# Altium schematic sheet PART1.SchDoc
size 558 x 431 mm
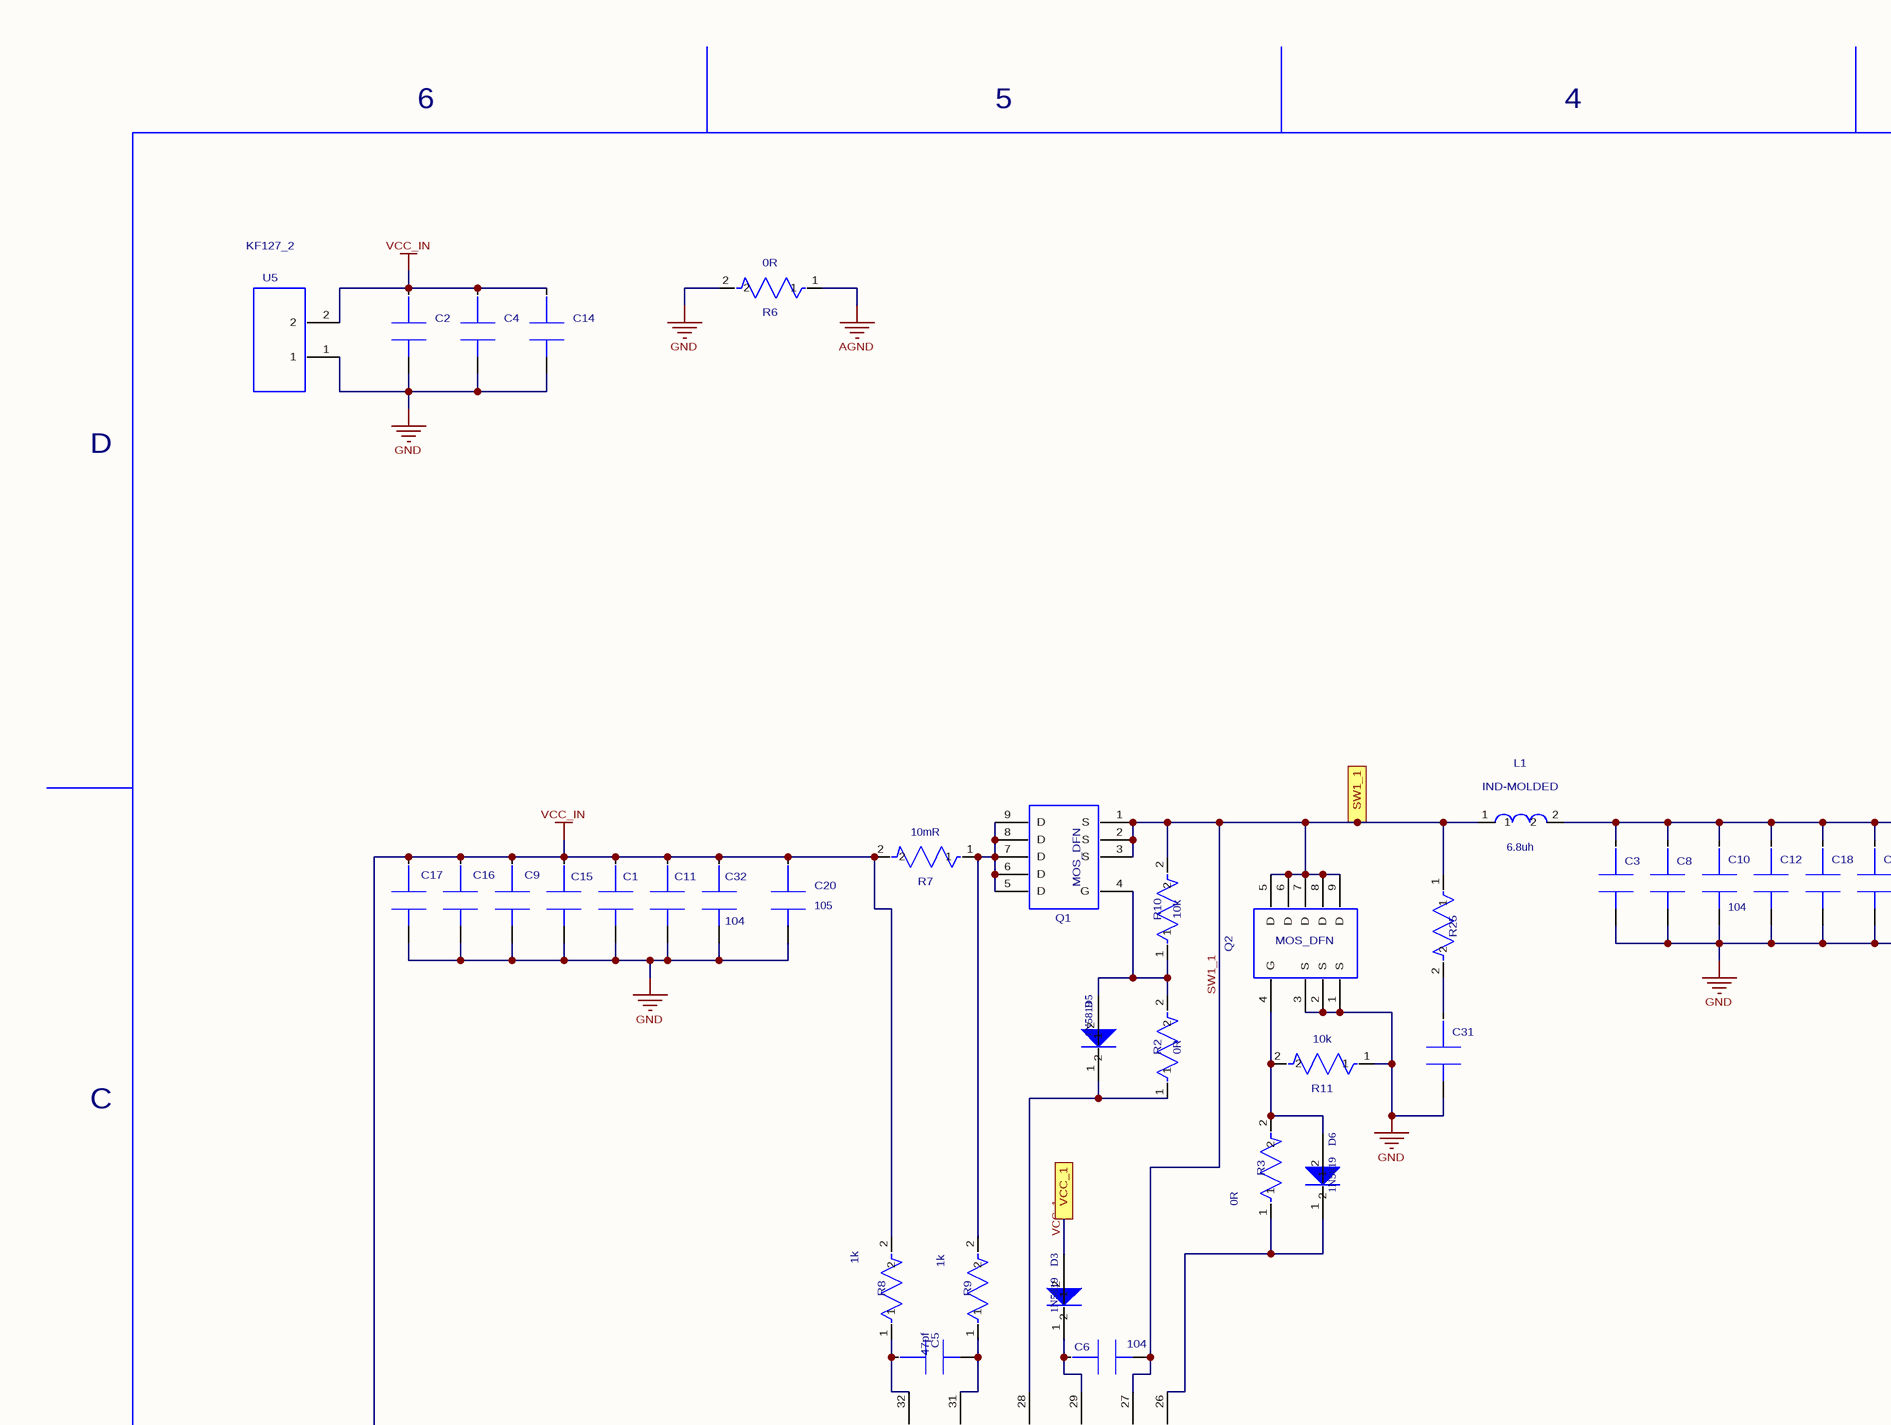
[diagram p0: PART1.SchDoc, top left]
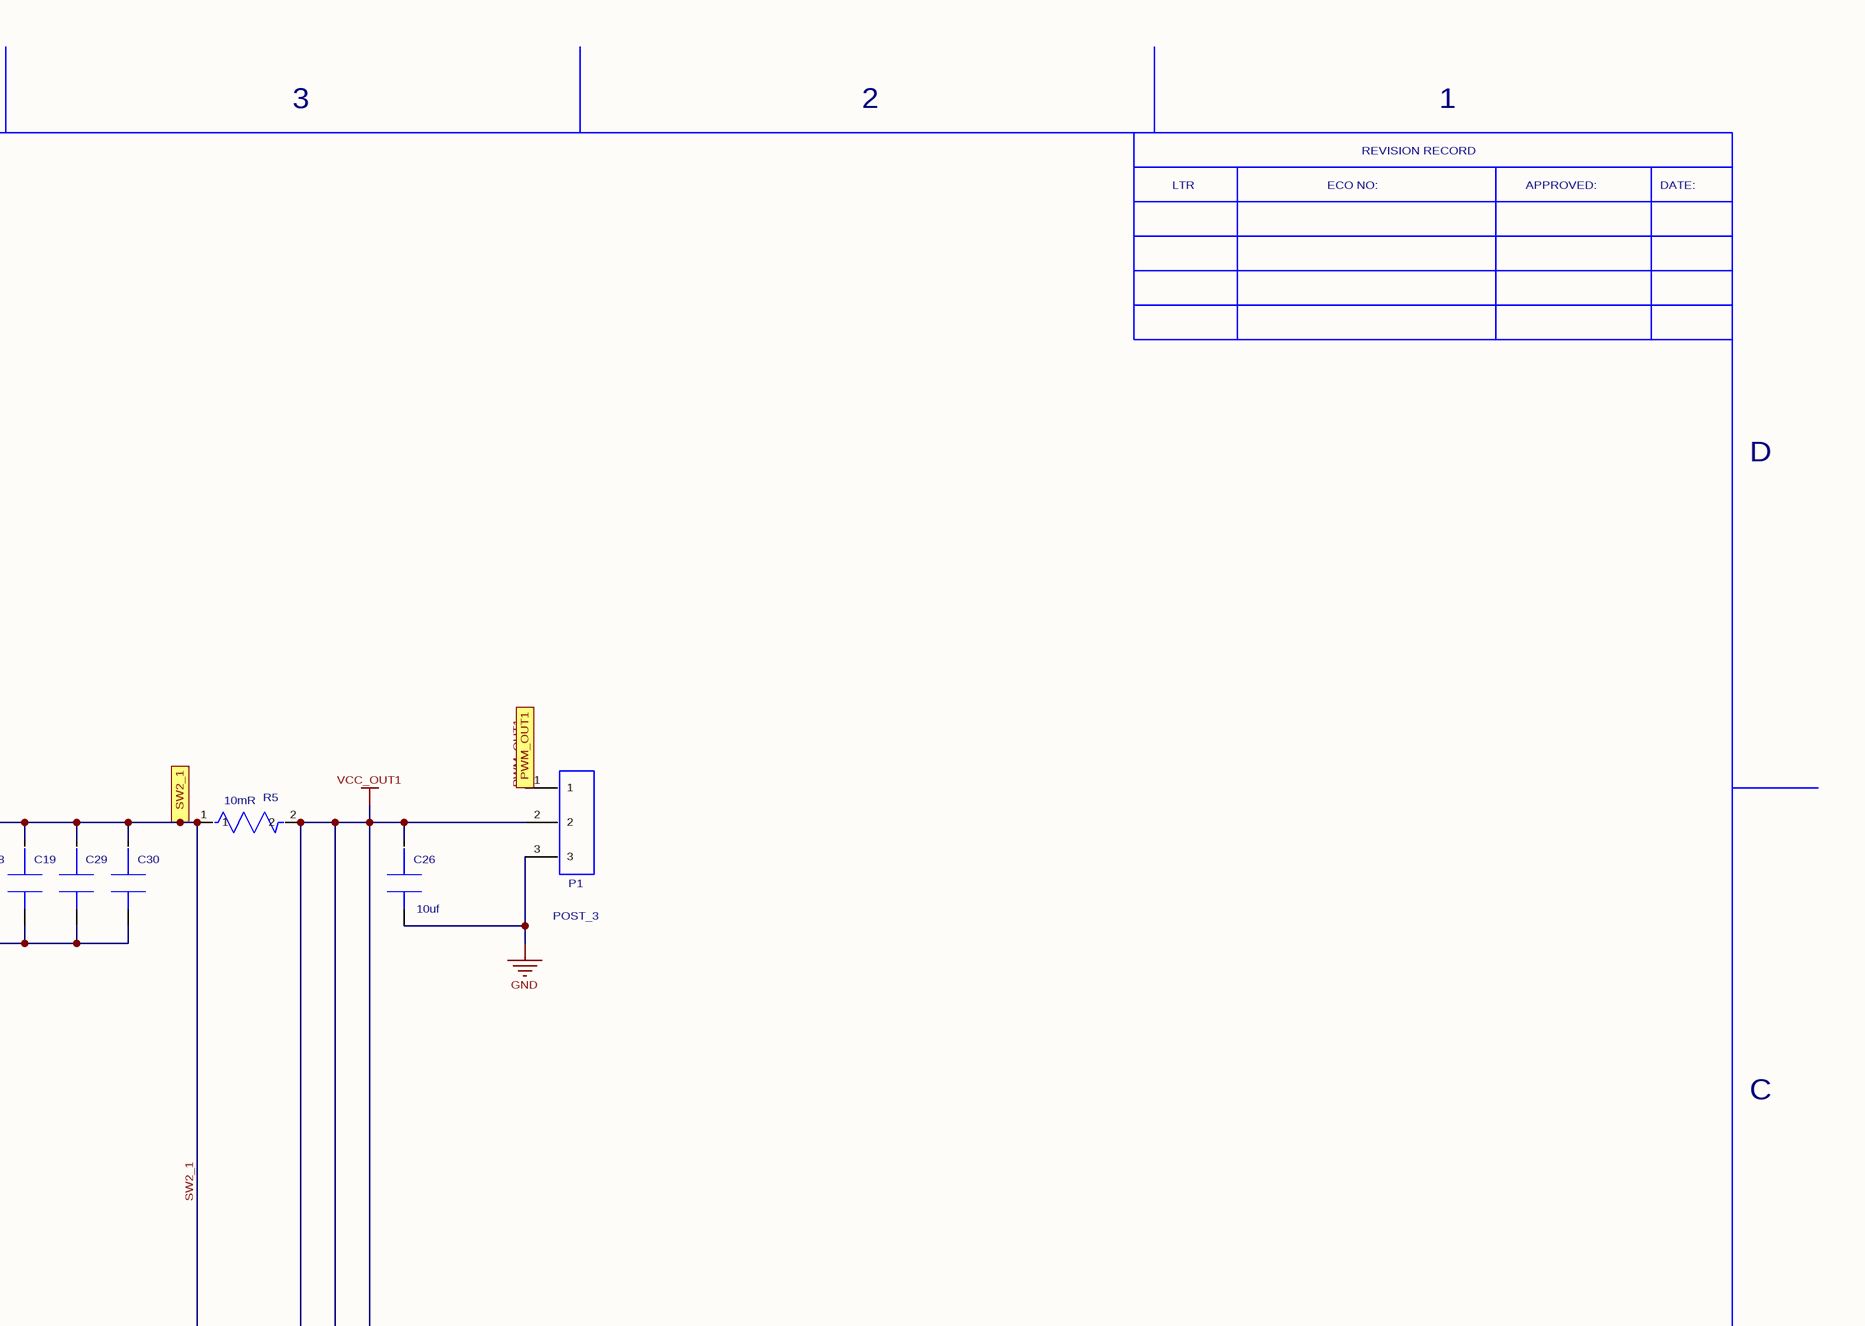
[diagram p1: PART1.SchDoc, top right]
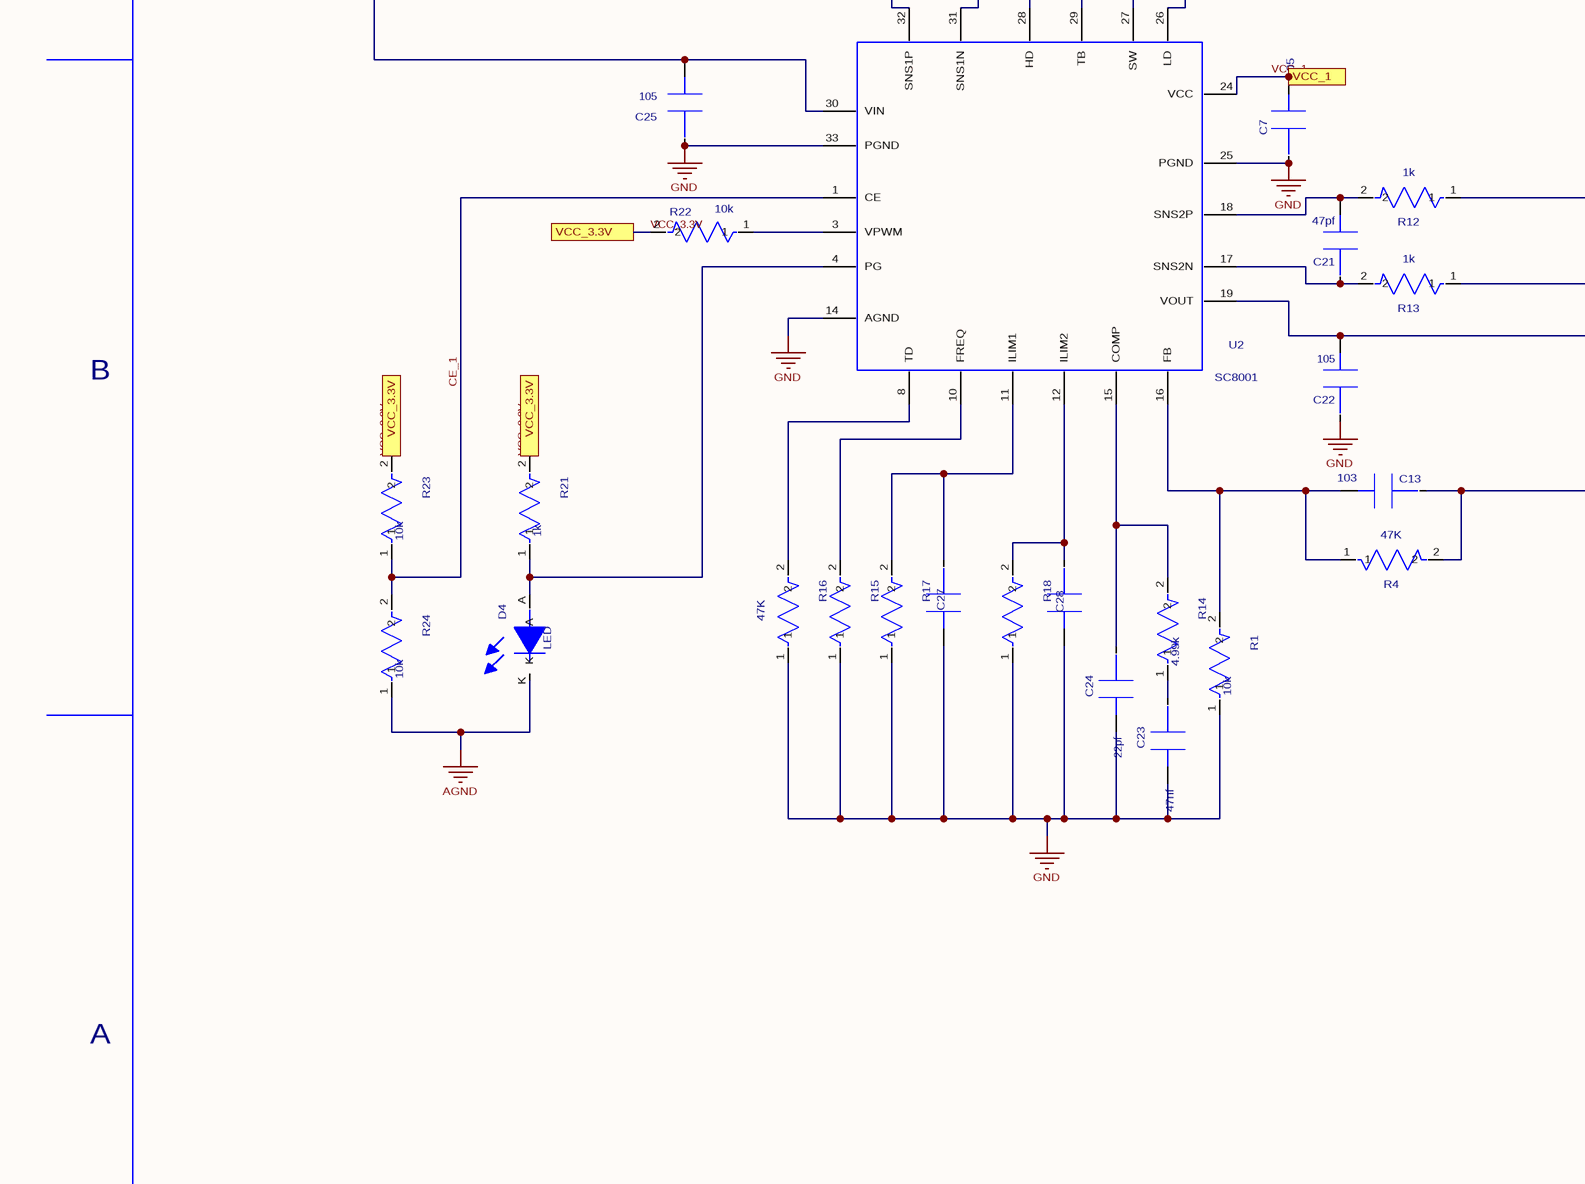
[diagram p2: PART1.SchDoc, bottom left]
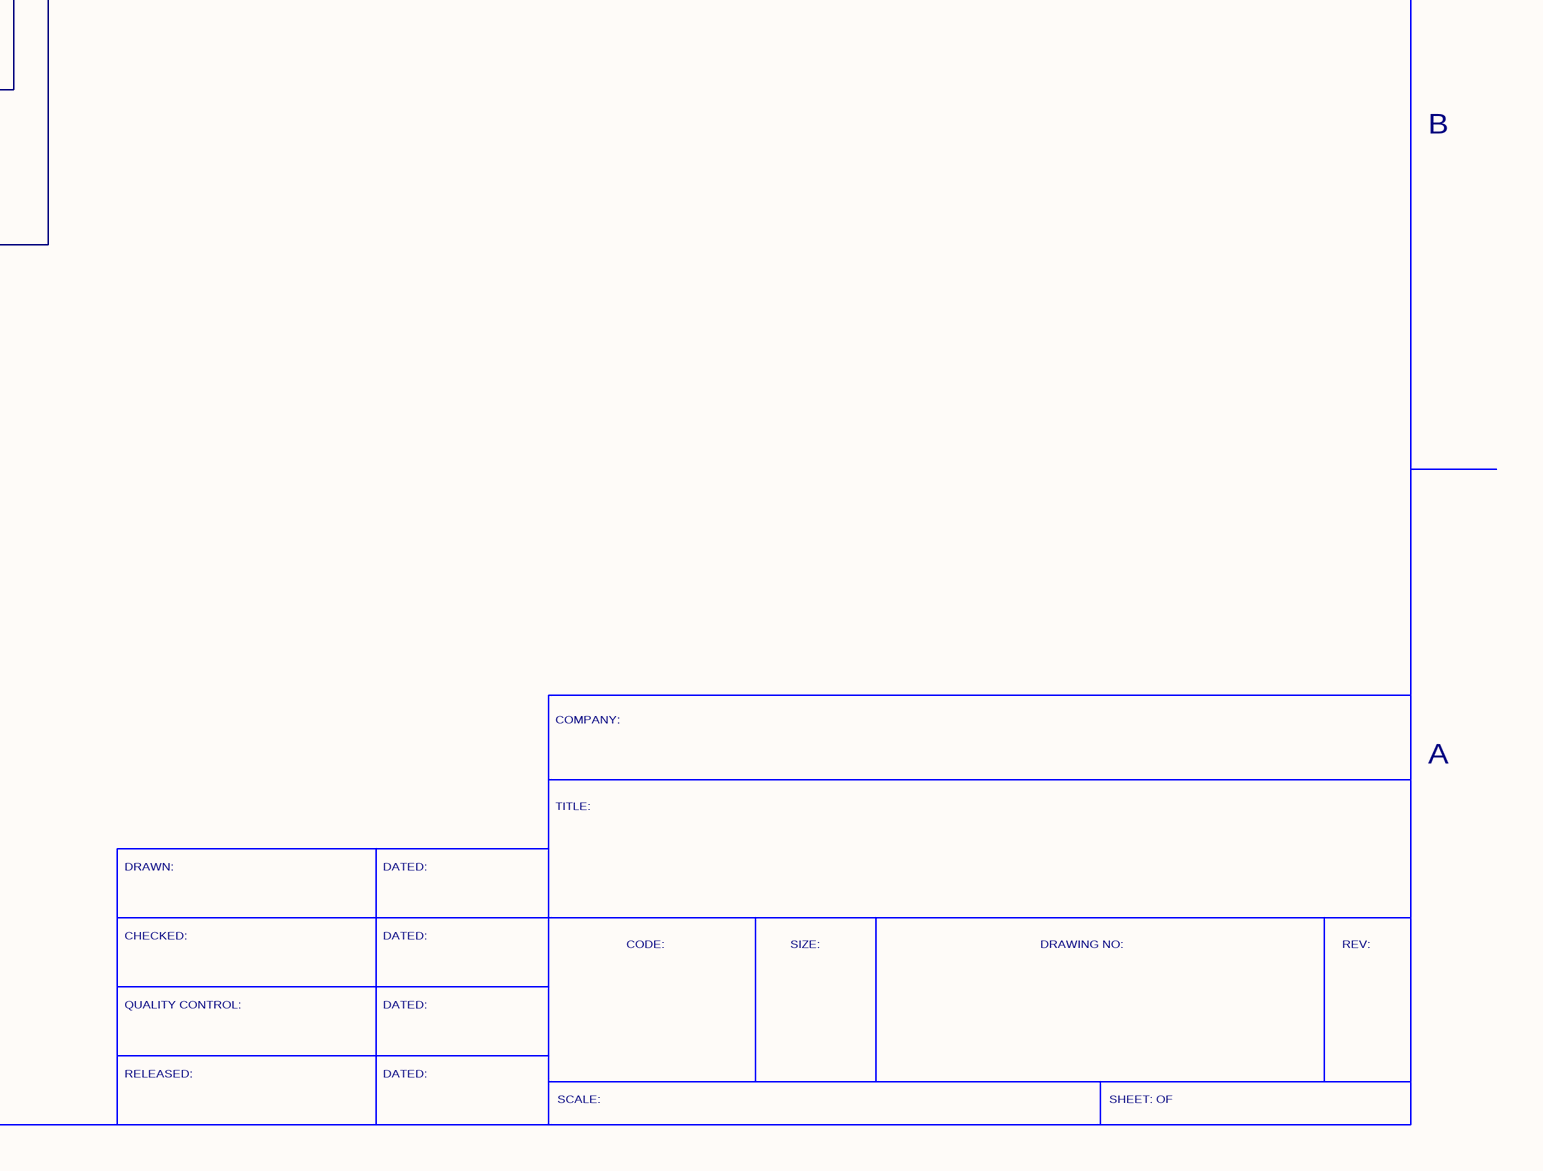
[diagram p3: PART1.SchDoc, bottom right]

## Parts
C1  CAP-CFR04R-C  [1210C]  (value not drawn)
C2  CAP-AE6.3  [CM_E(8_10.2)]  (value not drawn)
C3  CAP-AE6.3  [CC6.56.5]  (value not drawn)
C4  CAP-AE6.3  [CM_E(8_10.2)]  (value not drawn)
C5  value 47pf  [0603C]  (hidden comment: CAP-CFR04R-C)
C6  value 104  [0805C]  (hidden comment: CAP-CFR04R-C)
C7  value 105  [0805C]  (hidden comment: CAP-CFR04R-C)
C8  CAP-AE6.3  [CC6.56.5]  (value not drawn)
C9  CAP-CFR04R-C  [1210C]  (value not drawn)
C10  value 104  [1206C]  (hidden comment: CAP-CFR04R-C)
C11  CAP-CFR04R-C  [1210C]  (value not drawn)
C12  CAP-CFR04R-C  [1206C]  (value not drawn)
C13  value 103  [0603C]  (hidden comment: CAP-CFR04R-C)
C14  CAP-AE6.3  [CM_E(8_10.2)]  (value not drawn)
C15  CAP-CFR04R-C  [1210C]  (value not drawn)
C16  CAP-CFR04R-C  [1206C]  (value not drawn)
C17  CAP-CFR04R-C  [1210C]  (value not drawn)
C18  CAP-CFR04R-C  [1206C]  (value not drawn)
C19  CAP-CFR04R-C  [1206C]  (value not drawn)
C20  value 105  [0805C]  (hidden comment: CAP-CFR04R-C)
C21  value 47pf  [0603C]  (hidden comment: CAP-CFR04R-C)
C22  value 105  [0805C]  (hidden comment: CAP-CFR04R-C)
C23  value 47nf  [0603C]  (hidden comment: CAP-CFR04R-C)
C24  value 22pf  [0603C]  (hidden comment: CAP-CFR04R-C)
C25  value 105  [0805C]  (hidden comment: CAP-CFR04R-C)
C26  value 10uf  [1206C]  (hidden comment: CAP-CFR04R-C)
C27  CAP-CFR04R-C  [0603C]  (value not drawn)
C28  CAP-CFR04R-C  [0603C]  (value not drawn)
C29  CAP-CFR04R-C  [1206C]  (value not drawn)
C30  CAP-CFR04R-C  [1206C]  (value not drawn)
C31  CAP-CFR04R-C  [0805C]  (value not drawn)
C32  value 104  [0805C]  (hidden comment: CAP-CFR04R-C)
D3  1N5819  [SOD-123_L2.8-W1.8-LS3.7-RD]
D4  LED  [0805D]
D5  1N5819  [SOD-123_L2.8-W1.8-LS3.7-RD]
D6  1N5819  [SOD-123_L2.8-W1.8-LS3.7-RD]
L1  IND-MOLDED  value 6.8uh  [1040L]
P1  POST_3  [POST_3]
Q1  MOS_DFN  [DFN-8_5X6]
Q2  MOS_DFN  [DFN-8_5X6]
R1  value 10k  [0603R]  (hidden comment: RES-WR1)
R2  value 0R  [0603R]  (hidden comment: RES-WR1)
R3  value 0R  [0603R]  (hidden comment: RES-WR1)
R4  value 47K  [0603R]  (hidden comment: RES-WR1)
R5  value 10mR  [1206C]  (hidden comment: RES-WR1)
R6  value 0R  [1206C]  (hidden comment: RES-WR1)
R7  value 10mR  [1206C]  (hidden comment: RES-WR1)
R8  value 1k  [0603R]  (hidden comment: RES-WR1)
R9  value 1k  [0603R]  (hidden comment: RES-WR1)
R10  value 10k  [0603R]  (hidden comment: RES-WR1)
R11  value 10k  [0603R]  (hidden comment: RES-WR1)
R12  value 1k  [0603R]  (hidden comment: RES-WR1)
R13  value 1k  [0603R]  (hidden comment: RES-WR1)
R14  value 4.99k  [0603R]  (hidden comment: RES-WR1)
R15  RES-WR1  [0603R]  (value not drawn)
R16  47K  [0603R]
R17  RES-WR1  [0603R]  (value not drawn)
R18  39k  [0603R]  (value not drawn)
R21  value 1k  [0805R]  (hidden comment: RES-WR1)
R22  value 10k  [0805R]  (hidden comment: RES-WR1)
R23  value 10k  [0805R]  (hidden comment: RES-WR1)
R24  value 10k  [0805R]  (hidden comment: RES-WR1)
R25  RES-WR1  [1206C]  (value not drawn)
U2  SC8001  [QFN-32_L4.0-W4.0-P0.40-BL-EP2.7]
U5  KF127_2  [KF127_2]

## Ports
PWM_OUT1, SW1_1, SW2_1, VCC_1, VCC_3.3V

## Nets
AGND: D4.K R6.1 R24.1
GND: C1.2 C2.2 C3.2 C4.2 C7.1 C8.2 C9.2 C10.2 C11.2 C12.2 C14.2 C15.2 C16.2 C17.2 C18.2 C19.2 C20.2 C22.1 C23.2 C24.2 C25.1 C26.2 C27.2 C28.2 C29.2 C30.2 C31.2 C32.2 P1.3 Q2.1(S) Q2.2(S) Q2.3(S) R1.1 R6.2 R11.1 R15.1 R16.1 R17.1 R18.1 U2.14(AGND) U2.25(PGND) U2.33(PGND) U5.1
VCC_IN: C1.1 C2.1 C4.1 C9.1 C11.1 C14.1 C15.1 C16.1 C17.1 C20.1 C25.2 C32.1 R7.2 R8.2 U2.30(VIN) U5.2
VCC_OUT1: C13.1 C22.2 C26.1 P1.2 R4.2 R5.2 R13.1 U2.19(VOUT)
CE_1: R23.1 R24.2 U2.1(CE)
PWM_OUT1: P1.1 ; port PWM_OUT1
SW1_1: C6.2 L1.1 Q1.1(S) Q1.2(S) Q1.3(S) Q2.5(D) Q2.6(D) Q2.7(D) Q2.8(D) Q2.9(D) R10.2 R25.1 U2.27(SW) ; port SW1_1
SW2_1: C3.1 C8.1 C10.1 C12.1 C18.1 C19.1 C29.1 C30.1 L1.2 R5.1 R12.1 ; port SW2_1
VCC_1: C7.2 D3.2 U2.24(VCC) ; port VCC_1
VCC_3.3V: R21.2 R22.2 R23.2 ; port VCC_3.3V
NetC5_1: C5.1 R8.1 U2.32(SNS1P)
NetC5_2: C5.2 R9.1 U2.31(SNS1N)
NetC6_1: C6.1 D3.1 U2.29(TB)
NetC13_2: C13.2 R1.2 R4.1 U2.16(FB)
NetC21_1: C21.1 R13.2 U2.17(SNS2N)
NetC21_2: C21.2 R12.2 U2.18(SNS2P)
NetC23_1: C23.1 R14.1
NetC24_1: C24.1 R14.2 U2.15(COMP)
NetC27_1: C27.1 R17.2 U2.11(ILIM1)
NetC28_1: C28.1 R18.2 U2.12(ILIM2)
NetC31_1: C31.1 R25.2
NetD4_A: D4.A R21.1 U2.4(PG)
NetD5_1: D5.1 R2.1 U2.28(HD)
NetD5_2: D5.2 Q1.4(G) R2.2 R10.1
NetD6_1: D6.1 R3.1 U2.26(LD)
NetD6_2: D6.2 Q2.4(G) R3.2 R11.2
NetQ1_5: Q1.5(D) Q1.6(D) Q1.7(D) Q1.8(D) Q1.9(D) R7.1 R9.2
NetR15_2: R15.2 U2.10(FREQ)
NetR16_2: R16.2 U2.8(TD)
NetR22_1: R22.1 U2.3(VPWM)

## Notes on the sheet
- 6
- 5
- 4
- 3
- 2
- 1
- LTR
- ECO NO:
- REVISION RECORD
- APPROVED:
- DATE:
- D
- C
- B
- COMPANY:
- A
- TITLE:
- DRAWN:
- DATED:
- CHECKED:
- CODE:
- SIZE:
- DRAWING NO:
- REV:
- QUALITY CONTROL:
- RELEASED:
- SCALE:
- SHEET: OF

## Library data of the parts
C1 C9 C11 C12 C15-C19 C29-C31 = CAP-CFR04R-C: RADIAL FILM CAPACITOR, MIL-SPEC SIZE CFR04R SIZE 'C'; Manufacturer #1: KEMET; Part Number: TBD; Voltage Rating: ???; Value: 10uf; Sim.Analog.Prefix: C; Sim.Analog.Order: Model$; Tolerance: ???
  C1 C9 C11 C15 C17: PCB DECAL: 1210C
  C12 C16 C18 C19 C29 C30: PCB DECAL: 1206C
  C31: PCB DECAL: 0805C
C2-C4 C8 C14 = CAP-AE6.3: ALUMINUM ELECTROLYTIC CAP.; Manufacturer #1: IPC SM-782 STD.; Sim.Analog.Order: Model$; Sim.Analog.Prefix: C; Value: ???
  C2 C4 C14: PCB DECAL: CM_E(8_10.2)
  C3 C8: PCB DECAL: CC6.56.5
C5-C7 C10 C13 C20-C26 C32 = CAP-CFR04R-C: RADIAL FILM CAPACITOR, MIL-SPEC SIZE CFR04R SIZE 'C'; Manufacturer #1: KEMET; Part Number: TBD; Voltage Rating: ???; Sim.Analog.Prefix: C; Sim.Analog.Order: Model$; Tolerance: ???
  C5 C13 C21 C23 C24: PCB DECAL: 0603C
  C6 C7 C20 C22 C25 C32: PCB DECAL: 0805C
  C10 C26: PCB DECAL: 1206C
C27 C28 = CAP-CFR04R-C: RADIAL FILM CAPACITOR, MIL-SPEC SIZE CFR04R SIZE 'C'; Manufacturer #1: KEMET; Part Number: TBD; Voltage Rating: ???; Value: 103; Sim.Analog.Prefix: C; Sim.Analog.Order: Model$; Tolerance: ???; PCB DECAL: 0603C
D3 D5 D6 = DIODE_1N4148: High Conductance Fast Diode; ComponentLink2URL: http://www.fairchildsemi.com/ds/1N%2F1N4148.pdf; ComponentLink2Description: Datasheet; ComponentLink1URL: http://www.fairchildsemi.com/; ComponentLink1Description: Manufacturer Link; Code_JEDEC: DO-204-AH; PackageDescription: Diode, Axial; Body 3.8 x 1.9 mm (LxDia. max), Lead Dia. 0.53 mm (max); Publisher: Altium Limited; PackageReference: DO-35; DatasheetVersion: 1997; LatestRevisionNote: Re-released for DXP Platform.; LatestRevisionDate: 17-Jul-2002; Published: 8-Jun-2000; PCB DECAL: SOD-123_L2.8-W1.8-LS3.7-RD; Comment_1: DIODE_1N4148
D4 = LED: LIGHT EMITTING DIODE; Sim.Analog.Order: Model$; Sim.Analog.Prefix: D; Color: ???; PCB DECAL: 0805D
L1 = IND-MOLDED: MOLDED INDUCTOR, 0.5" PIN SPACING; Sim.Analog.Order: Model$; Sim.Analog.Prefix: L; PCB DECAL: 1040L
R1-R14 R21-R24 = RES-WR1: WIRE WOUND RESISTOR 3.4 X 7.05 MM; Manufacturer #1: IPC SM-782 STD.; Sim.Analog.Order: Model$; Sim.Analog.Prefix: R
  R1-R4 R8-R14: PCB DECAL: 0603R
  R5-R7: PCB DECAL: 1206C
  R21-R24: PCB DECAL: 0805R
R15 = RES-WR1: WIRE WOUND RESISTOR 3.4 X 7.05 MM; Manufacturer #1: IPC SM-782 STD.; Sim.Analog.Order: Model$; Sim.Analog.Prefix: R; Value: 0R; PCB DECAL: 0603R
R16 = RES-WR1: WIRE WOUND RESISTOR 3.4 X 7.05 MM; Manufacturer #1: IPC SM-782 STD.; Sim.Analog.Order: Model$; Sim.Analog.Prefix: R; Value: 68k; PCB DECAL: 0603R
R17 R18 R25 = RES-WR1: WIRE WOUND RESISTOR 3.4 X 7.05 MM; Manufacturer #1: IPC SM-782 STD.; Sim.Analog.Order: Model$; Sim.Analog.Prefix: R; Value: 10k
  R17 R18: PCB DECAL: 0603R
  R25: PCB DECAL: 1206C
P1 = POST_3: PCB DECAL: POST_3
Q1 Q2 = MOS_DFN: PCB DECAL: DFN-8_5X6
U2 = SC8001: PCB DECAL: QFN-32_L4.0-W4.0-P0.40-BL-EP2.7
U5 = KF127_2: PCB DECAL: KF127_2